# EAGLE schematic pwr (EAGLE 7.3.0)
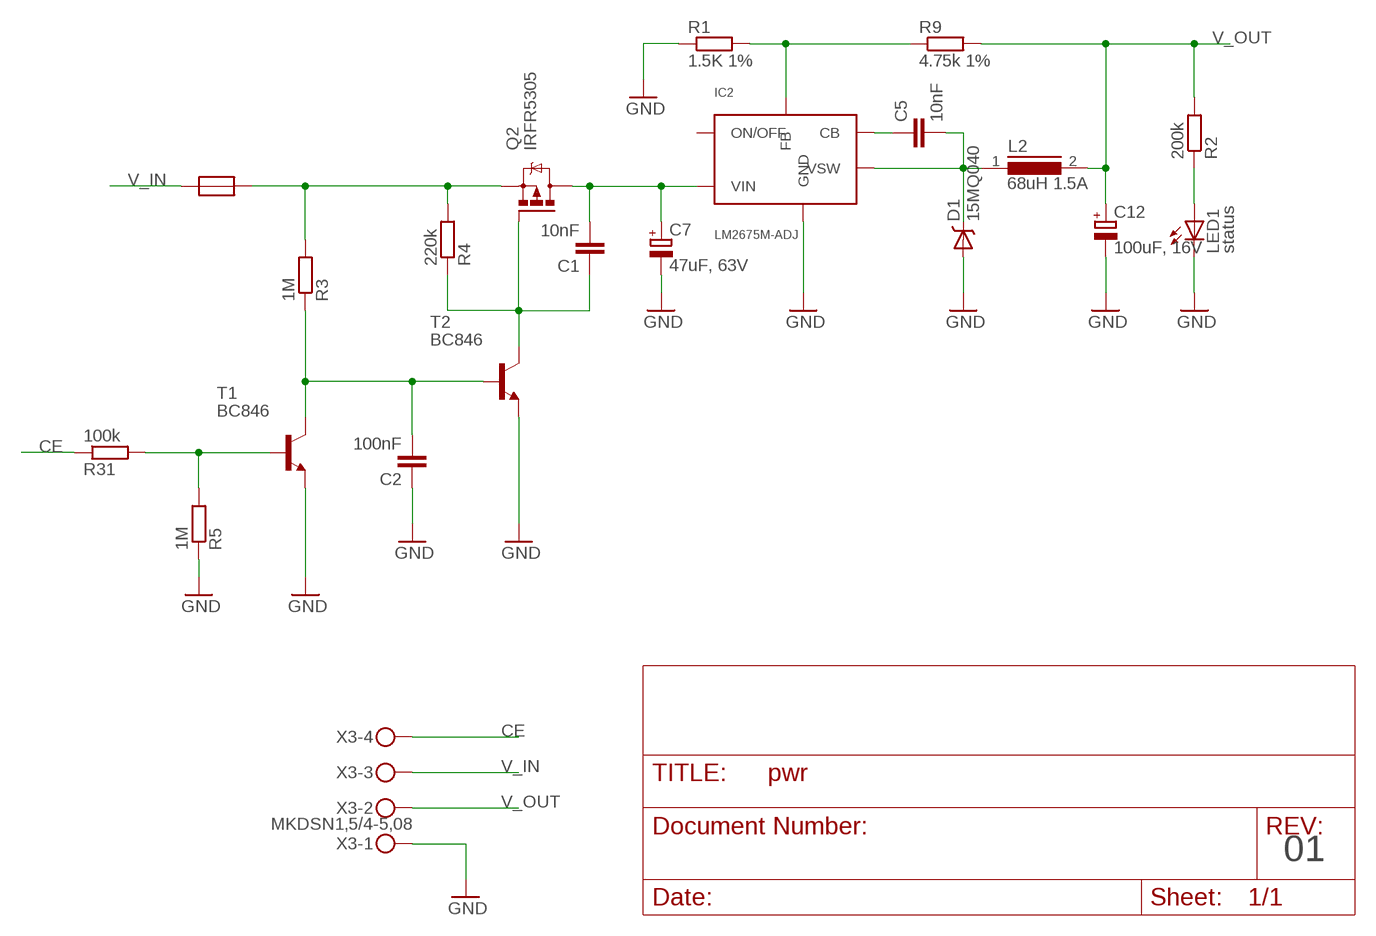
[diagram p0: schematic, sheet 1]

## Parts
C1  10nF  C-EUC0805  [C0805]
C2  100nF  C-EUC0805  [C0805]
C5  10nF  C-EUC0805  [C0805]
C7  47uF, 63V  CPOL-EUF  [PANASONIC_F]
C12  100uF, 16V  CPOL-EUD  [PANASONIC_D]
D1  15MQ040  DIODE-SCHOTTKY-MBRA140  [SMA-DIODE]
IC2  LM2675M-ADJ  LM2674  [SO-08]
L2  68uH 1.5A  DR125  [DR125]
LED1  status  LEDCHIP-LED0805  [CHIP-LED0805]
Q2  IRFR5305  [D-PAK_TO252AA]
R1  1.5K 1%  R-EU_R0805W  [R0805W]
R2  200k  R-EU_R0805W  [R0805W]
R3  1M  R-EU_R0805W  [R0805W]
R4  220k  R-EU_R0805W  [R0805W]
R5  1M  R-EU_R0805W  [R0805W]
R9  4.75k 1%  R-EU_R0805W  [R0805W]
R31  100k  R-EU_R0805W  [R0805W]
T1  BC846  [SOT23]
T2  BC846  [SOT23]
U$1  RESETTABLE_0805  [0805W]
X3  MKDSN1,5/4-5,08  [MKDSN1,5/4-5,08]

## Nets
CE: R31.1 X3.4
GND: C2.1 C7.- C12.- D1.A IC2.6(GND) LED1.C R1.1 R5.1 T1.2(E) T2.2(E) X3.1
N$1: LED1.A R2.1
N$2: C2.2 R3.1 T1.3(C) T2.1(B)
N$3: R5.2 R31.2 T1.1(B)
N$4: IC2.4(FB) R1.2 R9.1
N$5: Q2.3(S) R3.2 R4.2 U$1.2
N$9: C5.2 D1.C IC2.8(VSW) L2.1
N$10: C5.1 IC2.1(CB)
N$16: C1.1 Q2.1(G) R4.1 T2.3(C)
N$49: C1.2 C7.+ IC2.7(VIN) Q2.4(D)
V_IN: U$1.1 X3.3
V_OUT: C12.+ L2.2 R2.2 R9.2 X3.2
Unconnected: IC2.5(ON/OFF)

## Notes on the sheet
- 01

## Library data of the parts
C1 C2 C5 = rcl:C-EU: CAPACITOR, European symbol
C7 C12 = rcl:CPOL-EU: POLARIZED CAPACITOR, European symbol
D1 = SparkFun-DiscreteSemi:DIODE-SCHOTTKY: Schottky diodes in SFE's production catalog BAT20J 1A 23V 0.62Vf RB751 120mA 40V 0.37Vf PMEG4005EJ 0.5A 40V 0.42Vf MBRA140 1A 40V 0.5Vf B340A 3A 40V SMA; PROD_ID: DIO-08053; VALUE: MBRA140
IC2 = Simplex-ICs:LM2674: LM2674 power converter
L2 = inductors:DR125: High Power Density, High Efficiency, Shielded Inductors Source: coiltronics_dr_series.pdf
LED1 = led:LED: LED OSRAM: - CHIPLED LG R971, LG N971, LY N971, LG Q971, LY Q971, LO R971, LY R971 LH N974, LH R974 LS Q976, LO Q976, LY Q976 LO Q996 - Hyper CHIPLED LW Q18S LB Q993, LB Q99A, LB R99A - SideLED LS A670, LO A670, LY A670, LG A670, LP A670 LB A673, LV A673, LT A673, LW A673 LH A674 LY A675 LS A676, LA A676, LO A676, LY A676, LW A676 LS A679, LY A679, LG A679 - Hyper Micro SIDELED® LS Y876, LA Y876, LO Y876, LY Y876 LT Y87S - SmartLED LW L88C, LW L88S LB L89C, LB L89S, LG L890 LS L89K, LO L89K, LY L89K LS L896, LA L896, LO L896, LY L896 - TOPLED LS T670, LO T670, LY T670, LG T670, LP T670 LSG T670, LSP T670, LSY T670, LOP T670, LYG T670 LG T671, LOG T671, LSG T671 LB T673, LV T673, LT T673, LW T673 LH T674 LS T676, LA T676, LO T676, LY T676, LB T676, LH T676, LSB T676, LW T676 LB T67C, LV T67C, LT T67C, LS T67K, LO T67K, LY T67K, LW E67C LS E67B, LA E67B, LO E67B, LY E67B, LB E67C, LV E67C, LT E67C LW T67C LS T679, LY T679, LG T679 LS T770, LO T770, LY T770, LG T770, LP T770 LB T773, LV T773, LT T773, LW T773 LH T774 LS E675, LA E675, LY E675, LS T675 LS T776, LA T776, LO T776, LY T776, LB T776 LHGB T686 LT T68C, LB T68C - Hyper Mini TOPLED® LB M676 - Mini TOPLED Santana® LG M470 LS M47K, LO M47K, LY M47K Source: http://www.osram.convergy.de LUXEON: - LUMILED® LXK2-PW12-R00, LXK2-PW12-S00, LXK2-PW14-U00, LXK2-PW14-V00 LXK2-PM12-R00, LXK2-PM12-S00, LXK2-PM14-U00 LXK2-PE12-Q00, LXK2-PE12-R00, LXK2-PE12-S00, LXK2-PE14-T00, LXK2-PE14-U00 LXK2-PB12-K00, LXK2-PB12-L00, LXK2-PB12-M00, LXK2-PB14-N00, LXK2-PB14-P00, LXK2-PB14-Q00 LXK2-PR12-L00, LXK2-PR12-M00, LXK2-PR14-Q00, LXK2-PR14-R00 LXK2-PD12-Q00, LXK2-PD12-R00, LXK2-PD12-S00 LXK2-PH12-R00, LXK2-PH12-S00 LXK2-PL12-P00, LXK2-PL12-Q00, LXK2-PL12-R00 Source: www.luxeon.com KINGBRIGHT: KA-3528ASYC Source: www.kingbright.com
Q2 = transistor-power:IRF?5305: HEXFET Power MOSFET Source: http://www.irf.com/product-info/datasheets/data/irfr5305pbf.pdf
R1-R5 R9 R31 = rcl:R-EU_: RESISTOR, European symbol
T1 T2 = transistor:BC846: NPN TRANSISTOR
U$1 = Simplex-Fuses:RESETTABLE: resettable fuse
X3 = con-phoenix-508:MKDSN1,5/4-5,08: MKDSN 1,5/ 4-5,08 Printklemme Nennstrom: 13,5 A Nennspannung: 250 V Rastermaß: 5,08 mm Polzahl: 4 Anschlussart: Schraubanschluss Montage: Löten Anschlussrichtung Leiter/Platine: 0 ° Artikelnummer: 1729144 Source: http://eshop.phoenixcontact.com .. 1729144.pdf; MPN: SMKDSN1,5/4-5,08; OC_FARNELL: 1792905; OC_NEWARK: 70R0300

## Net classes
1 vcc: width 0.203 mm